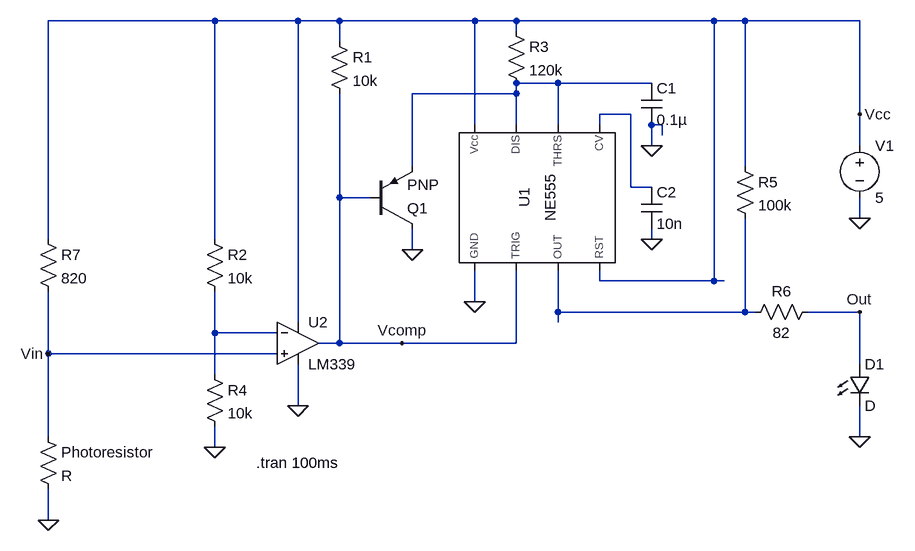
[diagram p0: schematic Laser Trip Detector.asc]
Laser Trip Detector.asc, the LTspice schematic file:
Version 4
SHEET 1 1656 680
WIRE -272 -144 -528 -144
WIRE -144 -144 -272 -144
WIRE -80 -144 -144 -144
WIRE 128 -144 -80 -144
WIRE 192 -144 128 -144
WIRE 496 -144 192 -144
WIRE 544 -144 496 -144
WIRE 720 -144 544 -144
WIRE 192 -128 192 -144
WIRE -80 -112 -80 -144
WIRE 256 -48 192 -48
WIRE 400 -48 256 -48
WIRE 192 -32 192 -48
WIRE 192 -32 32 -32
WIRE 368 0 320 0
WIRE 720 0 720 -144
WIRE 128 16 128 -144
WIRE 192 16 192 -32
WIRE 256 16 256 -48
WIRE 320 16 320 0
WIRE 416 16 400 16
WIRE 416 32 416 16
WIRE 400 48 400 16
WIRE 720 48 720 0
WIRE 32 80 32 -32
WIRE 544 80 544 -144
WIRE 368 112 368 0
WIRE 400 112 368 112
WIRE -80 128 -80 -32
WIRE -32 128 -80 128
WIRE 720 160 720 128
WIRE -528 192 -528 -144
WIRE -272 192 -272 -144
WIRE 400 192 400 176
WIRE 32 208 32 176
WIRE 320 256 320 240
WIRE 496 256 496 -144
WIRE 496 256 320 256
WIRE 512 256 496 256
WIRE 128 288 128 240
WIRE 256 304 256 240
WIRE 544 304 544 160
WIRE 544 304 256 304
WIRE 560 304 544 304
WIRE 720 304 640 304
WIRE -144 320 -144 -144
WIRE 256 320 256 304
WIRE -272 336 -272 272
WIRE -176 336 -272 336
WIRE -80 352 -80 128
WIRE -80 352 -112 352
WIRE 16 352 -80 352
WIRE 192 352 192 240
WIRE 192 352 16 352
WIRE -528 368 -528 272
WIRE -176 368 -528 368
WIRE 720 384 720 304
WIRE -272 400 -272 336
WIRE -144 448 -144 384
WIRE -528 496 -528 368
WIRE 720 496 720 448
WIRE -272 512 -272 480
WIRE -528 624 -528 576
FLAG 720 160 0
FLAG 720 0 Vcc
FLAG 128 288 0
FLAG 720 304 Out
FLAG -144 448 0
FLAG 400 48 0
FLAG -272 512 0
FLAG -528 368 Vin
FLAG -528 624 0
FLAG 16 352 Vcomp
FLAG 400 192 0
FLAG 32 208 0
FLAG 720 496 0
SYMBOL Misc\\NE555 224 128 R270
SYMATTR InstName U1
SYMBOL voltage 720 32 R0
WINDOW 123 0 0 Left 2
WINDOW 39 0 0 Left 2
SYMATTR InstName V1
SYMATTR Value 5
SYMBOL res -96 -128 R0
SYMATTR InstName R1
SYMATTR Value 10k
SYMBOL Comparators\\LM339 -144 288 R0
SYMATTR InstName U2
SYMBOL res 176 -144 R0
SYMATTR InstName R3
SYMATTR Value 120k
SYMBOL cap 384 -48 R0
SYMATTR InstName C1
SYMATTR Value 0.1µ
SYMBOL res -288 176 R0
SYMATTR InstName R2
SYMATTR Value 10k
SYMBOL res -288 384 R0
SYMATTR InstName R4
SYMATTR Value 10k
SYMBOL cap 384 112 R0
SYMATTR InstName C2
SYMATTR Value 10n
SYMBOL pnp -32 176 M180
SYMATTR InstName Q1
SYMBOL res 528 64 R0
SYMATTR InstName R5
SYMATTR Value 100k
SYMBOL LED 704 384 R0
SYMATTR InstName D1
SYMBOL res 656 288 R90
WINDOW 0 0 56 VBottom 2
WINDOW 3 32 56 VTop 2
SYMATTR InstName R6
SYMATTR Value 82
SYMBOL res -544 176 R0
SYMATTR InstName R7
SYMATTR Value 820
SYMBOL res -544 480 R0
SYMATTR InstName Photoresistor
TEXT -208 536 Left 2 !.tran 100ms

The netlist it stands for:
* Laser Trip Detector.asc
XU1 0 Vcomp N003 Vcc N002 N001 N001 Vcc NE555  ; pins GND TRIG OUT RST CV THRS DIS Vcc
V1 Vcc 0 5
R1 Vcc Vcomp 10k
XU2 Vin N004 Vcc 0 Vcomp LM339  ; pins In+ In- V+ V- OUT
R3 Vcc N001 120k
C1 N001 0 0.1µ
R2 Vcc N004 10k
R4 N004 0 10k
C2 N002 0 10n
Q1 0 Vcomp N001 0 PNP
R5 Vcc N003 100k
D1 Out 0 D
R6 Out N003 82
R7 Vcc Vin 820
R§Photoresistor Vin 0 R
.model D D
.lib standard.dio
.model NPN NPN
.model PNP PNP
.lib standard.bjt
.tran 100ms
.lib NE555.sub
.lib LM339.sub
.backanno
.end